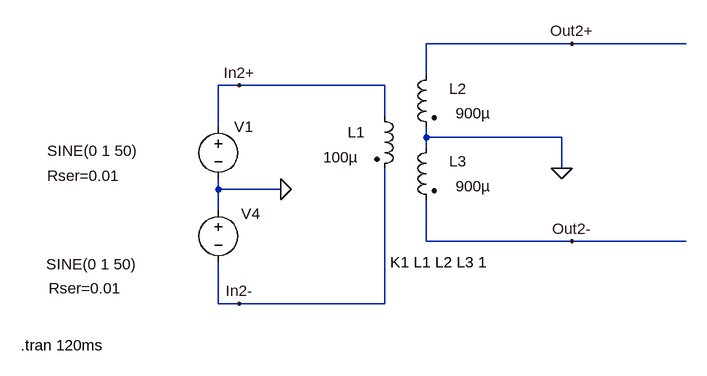
[diagram p0: schematic AC Power Flow ver 1.2.asc]
AC Power Flow ver 1.2.asc, the LTspice schematic file:
Version 4
SHEET 1 880 680
WIRE -192 -160 -416 -160
WIRE -16 -160 -192 -160
WIRE -416 -112 -416 -160
WIRE -704 -96 -736 -96
WIRE -480 -96 -704 -96
WIRE -480 -48 -480 -96
WIRE -736 -32 -736 -96
WIRE -416 -16 -416 -32
WIRE -208 -16 -416 -16
WIRE -416 0 -416 -16
WIRE -208 32 -208 -16
WIRE -736 64 -736 48
WIRE -640 64 -736 64
WIRE -736 96 -736 64
WIRE -416 144 -416 80
WIRE -192 144 -416 144
WIRE -16 144 -192 144
WIRE -736 240 -736 176
WIRE -704 240 -736 240
WIRE -480 240 -480 32
WIRE -480 240 -704 240
FLAG -640 64 0
FLAG -192 -160 Out2+
FLAG -704 -96 In2+
FLAG -192 144 Out2-
FLAG -704 240 In2-
FLAG -208 32 0
SYMBOL ind2 -496 -64 R0
WINDOW 0 -41 40 Left 2
WINDOW 3 -79 79 Left 2
SYMATTR InstName L1
SYMATTR Value 100µ
SYMATTR Type ind
SYMATTR SpiceLine Rser=0.01
SYMBOL ind2 -400 -128 M0
WINDOW 0 -46 37 Left 2
WINDOW 3 -83 75 Left 2
SYMATTR InstName L2
SYMATTR Value 900µ
SYMATTR Type ind
SYMATTR SpiceLine Rser=.01
SYMBOL voltage -736 -48 R0
WINDOW 3 -263 53 Left 2
WINDOW 123 0 0 Left 2
WINDOW 39 -263 91 Left 2
SYMATTR Value SINE(0 1 50)
SYMATTR SpiceLine Rser=0.01
SYMATTR InstName V1
SYMBOL ind2 -400 -16 M0
WINDOW 0 -46 37 Left 2
WINDOW 3 -83 75 Left 2
SYMATTR InstName L3
SYMATTR Value 900µ
SYMATTR Type ind
SYMATTR SpiceLine Rser=0.01
SYMBOL voltage -736 80 R0
WINDOW 0 35 22 Left 2
WINDOW 3 -265 99 Left 2
WINDOW 123 0 0 Left 2
WINDOW 39 -261 136 Left 2
SYMATTR InstName V4
SYMATTR Value SINE(0 1 50)
SYMATTR SpiceLine Rser=0.01
TEXT -1040 304 Left 2 !.tran 120ms
TEXT -472 176 Left 2 !K1 L1 L2 L3 1

The netlist it stands for:
* AC Power Flow ver 1.2.asc
L1 In2+ In2- 100µ Rser=0.01
L2 Out2+ 0 900µ Rser=.01
V1 In2+ 0 SINE(0 1 50) Rser=0.01
L3 0 Out2- 900µ Rser=0.01
V4 0 In2- SINE(0 1 50) Rser=0.01
.tran 120ms
K1 L1 L2 L3 1
.backanno
.end